# Altium schematic sheet scm-1.SchDoc: Test-scm1
size A4; Date: 2019-05-04; Author: Benjamin142857; DrawnBy: Benjamin142857; Engineer: Benjamin142857; ImagePath: C:\Program Files\Altium Designer Summer 09\Examples\20180504-Test1
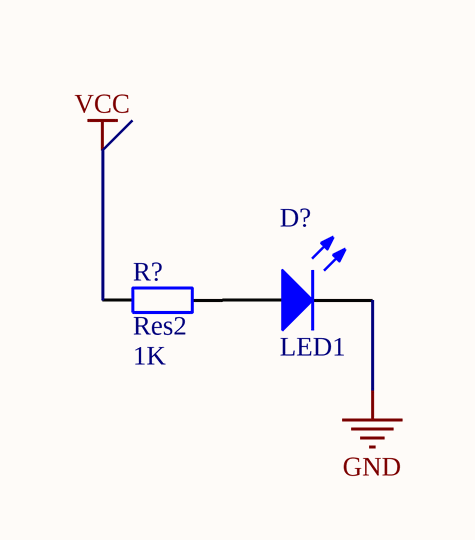
[diagram p0: scm-1.SchDoc]

## Parts
D?  LED1  [LED-1]
R?  Res2  value 1K  [AXIAL-0.4]

## Nets
GND: D?.2(K)
VCC: R?.1
NetD?_1: D?.1(A) R?.2

## Library data of the parts
D? = LED1: Typical RED GaAs LED; Published: 8-Jun-2000; LatestRevisionDate: 08-Jul-2005; LatestRevisionNote: Mech Layer 1 removed.; PackageReference: LED-1; Publisher: Altium Limited
R? = Res2: Resistor; Published: 8-Jun-2000; LatestRevisionDate: 17-Jul-2002; LatestRevisionNote: Re-released for DXP Platform.; PackageReference: AXIAL-0.4; Publisher: Altium Limited